# EAGLE board IF_TEST_1 (EAGLE 6.5.0)
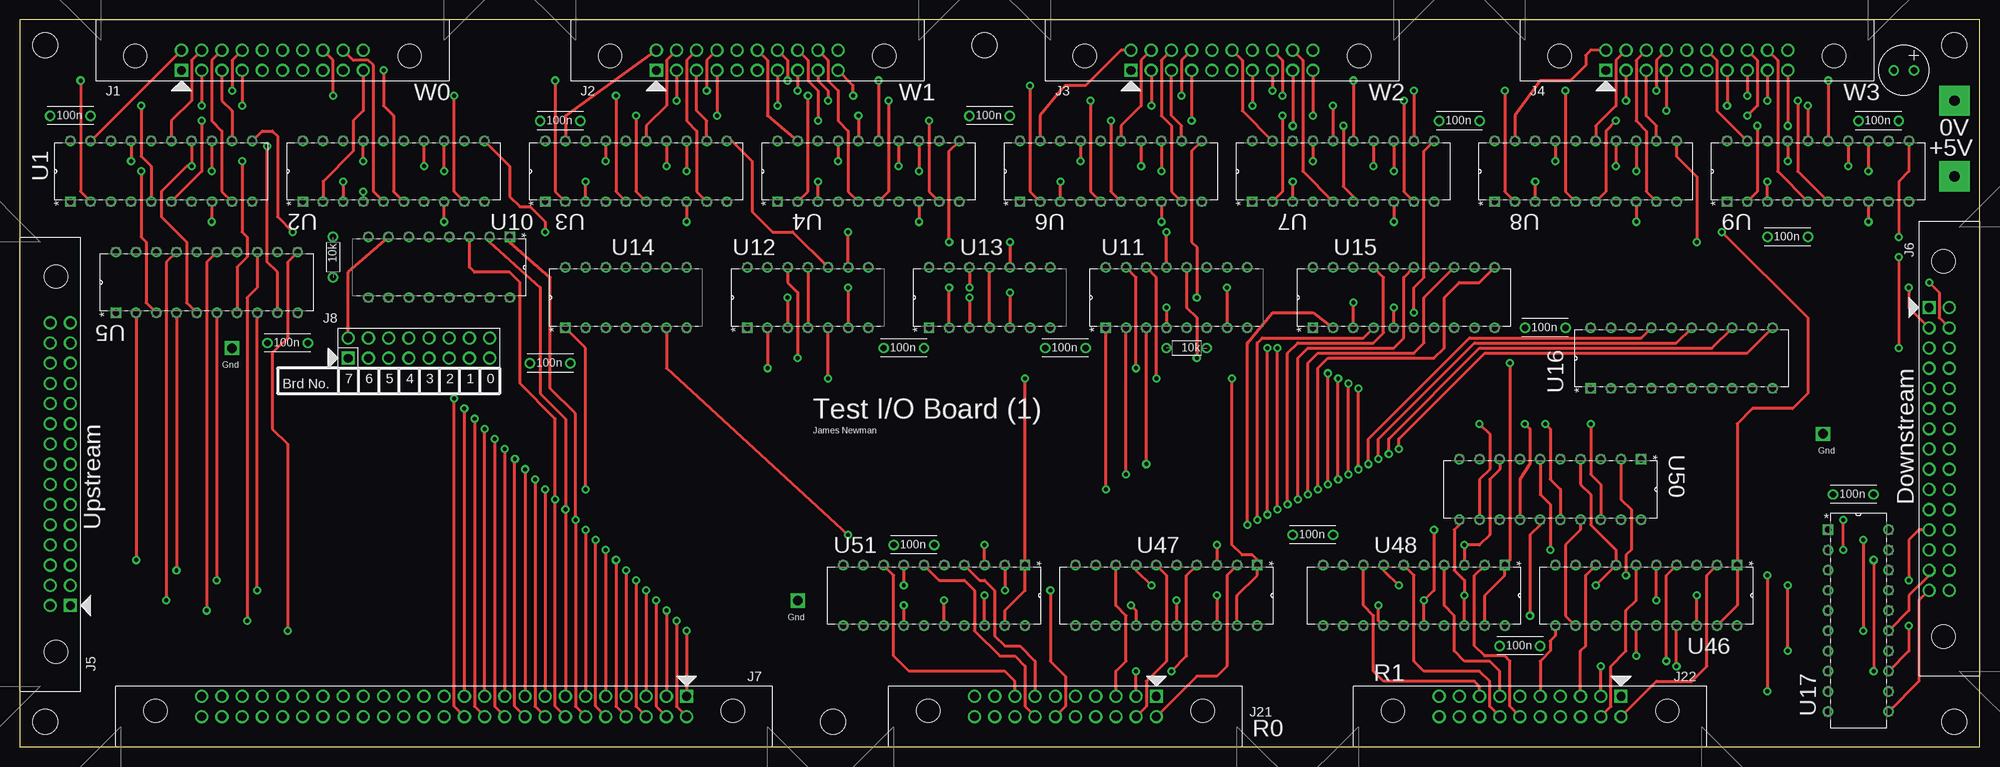
[diagram p6: board, top side]
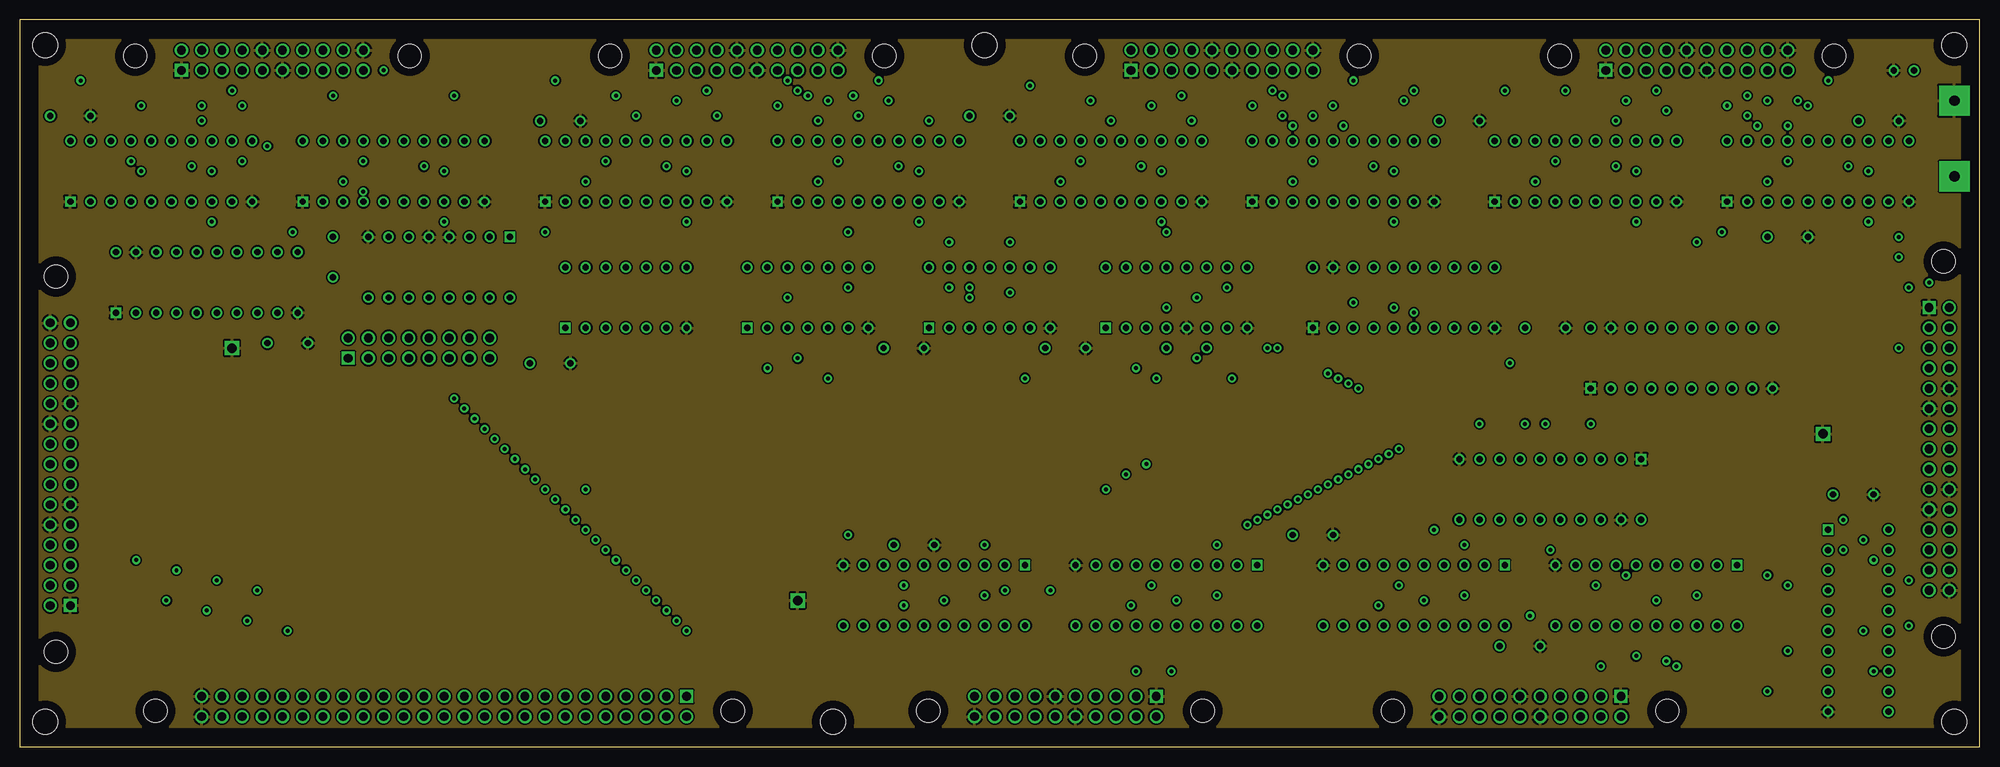
[diagram p7: board, inner layer Route2]
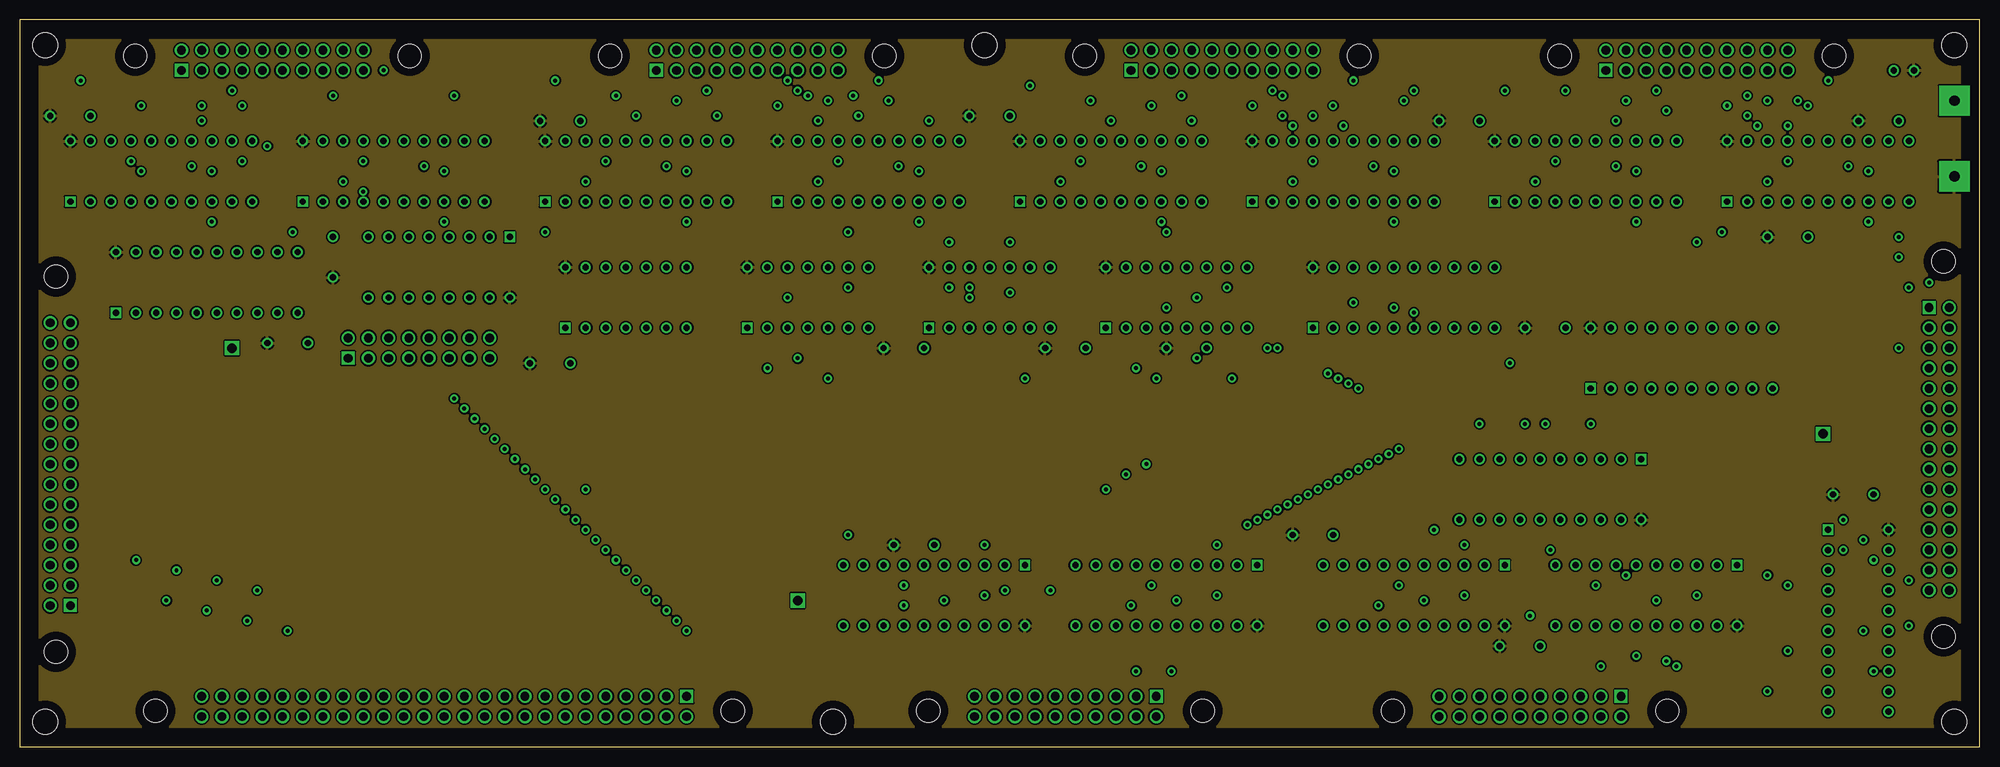
[diagram p8: board, inner layer Route3]
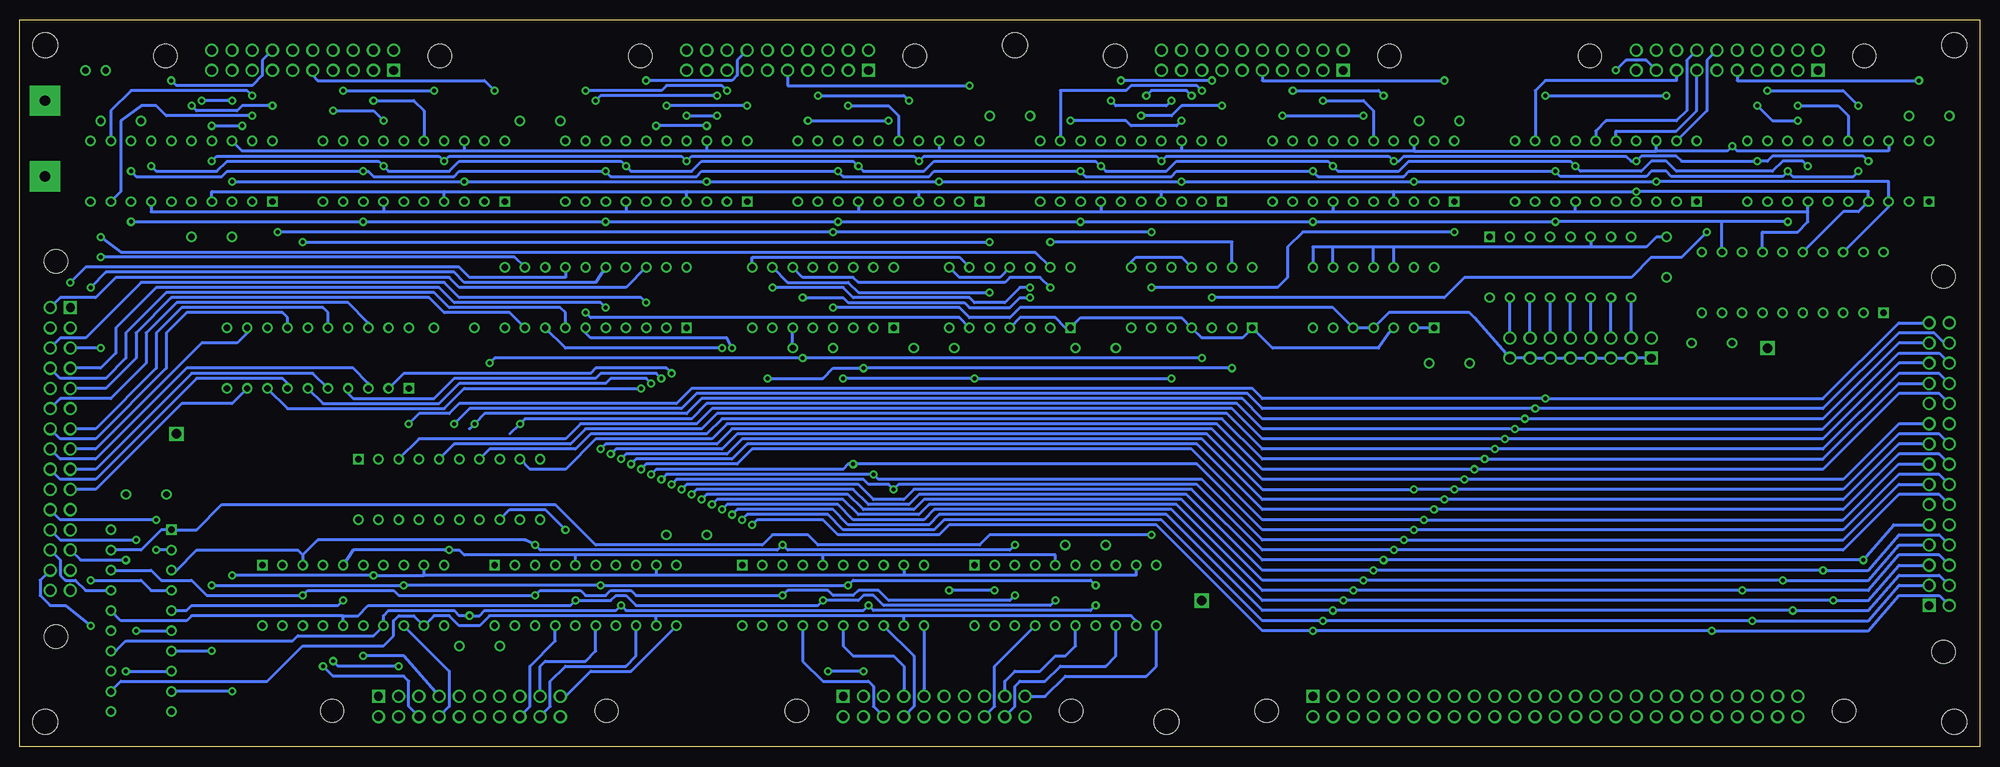
[diagram p9: board, bottom side, seen from below]

Size 246.38 x 91.44 mm. Coordinates in mm from the lower left corner, seen from the top.
Outline: 0,0 246.38,0 246.38,91.44 0,91.44 0,0
Copper layers (1*2+3*16): Top 0.035mm / dielectric 0.2mm / Route2 0.035mm / dielectric 1mm / Route3 0.035mm / dielectric 0.2mm / Bottom 0.035mm
Design rules "processor_rules_4layer": minimum track width 10mil, minimum drill 0.0236mm, track to track 8mil, track to pad 8mil, pad to pad 8mil, via to via 8mil, smd to smd 8mil, copper to edge 40mil, drill to drill 8mil, minimum pad ring 10mil, minimum via ring 8mil, stop-mask expansion 4mil, vias tented up to drill 0.7mm, thermal gap 10mil

## Footprints (pad centres in the part's own frame; a part is rotated, then mirrored left to right if it is on the bottom)
POLARISED_CAP_2P5_6P3MM = drill 0.8: A 1.27,0; K -1.27,0
CAP_P2INCH = drill 0.8: 1 -2.54,0; 2 2.54,0
3M_HOLE = hole 3.2: 0,0
20_HDR_LOCKING_RA = drill 1.1 square: 1 -11.43,-1.27 | drill 1.1: 2 -11.43,1.27; 3 -8.89,-1.27; 4 -8.89,1.27; 5 -6.35,-1.27; 6 -6.35,1.27; 7 -3.81,-1.27; 8 -3.81,1.27; 9 -1.27,-1.27; 10 -1.27,1.27; 11 1.27,-1.27; 12 1.27,1.27; 13 3.81,-1.27; 14 3.81,1.27; 15 6.35,-1.27; 16 6.35,1.27; 17 8.89,-1.27; 18 8.89,1.27; 19 11.43,-1.27; 20 11.43,1.27 | hole 2.946: -17.247,0.533; 17.247,0.533
30_HDR_LOCKING_RA = drill 1.1 square: 1 -17.78,-1.27 | drill 1.1: 2 -17.78,1.27; 3 -15.24,-1.27; 4 -15.24,1.27; 5 -12.7,-1.27; 6 -12.7,1.27; 7 -10.16,-1.27; 8 -10.16,1.27; 9 -7.62,-1.27; 10 -7.62,1.27; 11 -5.08,-1.27; 12 -5.08,1.27; 13 -2.54,-1.27; 14 -2.54,1.27; 15 0,-1.27; 16 0,1.27; 17 2.54,-1.27; 18 2.54,1.27; 19 5.08,-1.27; 20 5.08,1.27; 21 7.62,-1.27; 22 7.62,1.27; 23 10.16,-1.27; 24 10.16,1.27; 25 12.7,-1.27; 26 12.7,1.27; 27 15.24,-1.27; 28 15.24,1.27; 29 17.78,-1.27; 30 17.78,1.27 | hole 2.946: -23.597,0.533; 23.597,0.533
50_HDR_LOCKING_RA = drill 1.1 square: 1 -30.48,-1.27 | drill 1.1: 2 -30.48,1.27; 3 -27.94,-1.27; 4 -27.94,1.27; 5 -25.4,-1.27; 6 -25.4,1.27; 7 -22.86,-1.27; 8 -22.86,1.27; 9 -20.32,-1.27; 10 -20.32,1.27; 11 -17.78,-1.27; 12 -17.78,1.27; 13 -15.24,-1.27; 14 -15.24,1.27; 15 -12.7,-1.27; 16 -12.7,1.27; 17 -10.16,-1.27; 18 -10.16,1.27; 19 -7.62,-1.27; 20 -7.62,1.27; 21 -5.08,-1.27; 22 -5.08,1.27; 23 -2.54,-1.27; 24 -2.54,1.27; 25 0,-1.27; 26 0,1.27; 27 2.54,-1.27; 28 2.54,1.27; 29 5.08,-1.27; 30 5.08,1.27; 31 7.62,-1.27; 32 7.62,1.27; 33 10.16,-1.27; 34 10.16,1.27; 35 12.7,-1.27; 36 12.7,1.27; 37 15.24,-1.27; 38 15.24,1.27; 39 17.78,-1.27; 40 17.78,1.27; 41 20.32,-1.27; 42 20.32,1.27; 43 22.86,-1.27; 44 22.86,1.27; 45 25.4,-1.27; 46 25.4,1.27; 47 27.94,-1.27; 48 27.94,1.27; 49 30.48,-1.27; 50 30.48,1.27 | hole 2.946: -36.297,0.533; 36.297,0.533
JUMP_8X2 = drill 1.1 square: 1 -8.89,-1.27 | drill 1.1: 2 -8.89,1.27; 3 -6.35,-1.27; 4 -6.35,1.27; 5 -3.81,-1.27; 6 -3.81,1.27; 7 -1.27,-1.27; 8 -1.27,1.27; 9 1.27,-1.27; 10 1.27,1.27; 11 3.81,-1.27; 12 3.81,1.27; 13 6.35,-1.27; 14 6.35,1.27; 15 8.89,-1.27; 16 8.89,1.27
POWER_PAD = drill 1.3 pad 3.81 square: 1 0,0
R_P2INCH = drill 0.8: 1 -2.54,0; 2 2.54,0
TEST_LOOP = drill 1.2 square: P$1 0,0
DIP20 = drill 0.8 square: 1 -3.81,11.43 | drill 0.8: 2 -3.81,8.89; 3 -3.81,6.35; 4 -3.81,3.81; 5 -3.81,1.27; 6 -3.81,-1.27; 7 -3.81,-3.81; 8 -3.81,-6.35; 9 -3.81,-8.89; 10 -3.81,-11.43; 11 3.81,-11.43; 12 3.81,-8.89; 13 3.81,-6.35; 14 3.81,-3.81; 15 3.81,-1.27; 16 3.81,1.27; 17 3.81,3.81; 18 3.81,6.35; 19 3.81,8.89; 20 3.81,11.43
DIP16 = drill 0.8 square: 1 -3.81,8.89 | drill 0.8: 2 -3.81,6.35; 3 -3.81,3.81; 4 -3.81,1.27; 5 -3.81,-1.27; 6 -3.81,-3.81; 7 -3.81,-6.35; 8 -3.81,-8.89; 9 3.81,-8.89; 10 3.81,-6.35; 11 3.81,-3.81; 12 3.81,-1.27; 13 3.81,1.27; 14 3.81,3.81; 15 3.81,6.35; 16 3.81,8.89
DIP14 = drill 0.8 square: 1 -3.81,7.62 | drill 0.8: 2 -3.81,5.08; 3 -3.81,2.54; 4 -3.81,0; 5 -3.81,-2.54; 6 -3.81,-5.08; 7 -3.81,-7.62; 8 3.81,-7.62; 9 3.81,-5.08; 10 3.81,-2.54; 11 3.81,0; 12 3.81,2.54; 13 3.81,5.08; 14 3.81,7.62

## Placement (x,y rotation side)
C1  100u  [POLARISED_CAP_2P5_6P3MM]  236.85,85.09 0 top
C2  100n  [CAP_P2INCH]  230.5,31.75 0 top
C3  100n  [CAP_P2INCH]  162.56,26.67 0 top
C4  100n  [CAP_P2INCH]  6.35,79.38 0 top
C5  100n  [CAP_P2INCH]  233.68,78.74 0 top
C6  100n  [CAP_P2INCH]  180.97,78.74 0 top
C7  100n  [CAP_P2INCH]  121.92,79.38 0 top
C8  100n  [CAP_P2INCH]  66.67,48.26 0 top
C9  100n  [CAP_P2INCH]  67.94,78.74 0 top
C10  100n  [CAP_P2INCH]  33.66,50.8 0 top
C11  100n  [CAP_P2INCH]  111.12,50.16 0 top
C12  100n  [CAP_P2INCH]  131.44,50.16 0 top
C13  100n  [CAP_P2INCH]  222.25,64.14 0 top
C14  100n  [CAP_P2INCH]  191.77,52.7 0 top
C15  100n  [CAP_P2INCH]  112.39,25.4 0 top
C16  100n  [CAP_P2INCH]  188.59,12.7 0 top
HOLE1  3M_MOUNT_HOLE  [3M_HOLE]  3.17,3.17 0 top
HOLE2  3M_MOUNT_HOLE  [3M_HOLE]  102.23,3.17 0 top
HOLE3  3M_MOUNT_HOLE  [3M_HOLE]  243.21,88.27 0 top
HOLE4  3M_MOUNT_HOLE  [3M_HOLE]  243.21,3.17 0 top
HOLE5  3M_MOUNT_HOLE  [3M_HOLE]  121.28,88.27 0 top
HOLE6  3M_MOUNT_HOLE  [3M_HOLE]  3.17,88.27 0 top
J1  20_HDR_LOCKING_RA  [20_HDR_LOCKING_RA]  31.75,86.36 0 top
J2  20_HDR_LOCKING_RA  [20_HDR_LOCKING_RA]  91.44,86.36 0 top
J3  20_HDR_LOCKING_RA  [20_HDR_LOCKING_RA]  151.13,86.36 0 top
J4  20_HDR_LOCKING_RA  [20_HDR_LOCKING_RA]  210.82,86.36 0 top
J5  30_HDR_LOCKING_RA  [30_HDR_LOCKING_RA]  5.08,35.56 90 top
J6  30_HDR_LOCKING_RA  [30_HDR_LOCKING_RA]  241.3,37.47 270 top
J7  50_HDR_LOCKING_RA  [50_HDR_LOCKING_RA]  53.34,5.08 180 top
J8  JUMP_8X2  [JUMP_8X2]  50.16,50.16 0 top
J21  20_HDR_LOCKING_RA  [20_HDR_LOCKING_RA]  131.44,5.08 180 top
J22  20_HDR_LOCKING_RA  [20_HDR_LOCKING_RA]  189.87,5.08 180 top
PP1  POWER_PAD  [POWER_PAD]  243.21,71.75 0 top
PP2  POWER_PAD  [POWER_PAD]  243.21,81.28 0 top
R1  10k  [R_P2INCH]  146.69,50.16 180 top
R2  10k  [R_P2INCH]  39.37,61.59 270 top
TP1  [TEST_LOOP]  97.79,18.41 0 top
TP2  [TEST_LOOP]  226.69,39.37 0 top
TP3  [TEST_LOOP]  26.67,50.16 0 top
U1  74LS374  [DIP20]  17.78,72.39 90 top
U2  74LS374  [DIP20]  46.99,72.39 90 top
U3  74LS374  [DIP20]  77.47,72.39 90 top
U4  74LS374  [DIP20]  106.68,72.39 90 top
U5  74LS244  [DIP20]  23.5,58.42 90 top
U6  74LS374  [DIP20]  137.16,72.39 90 top
U7  74LS374  [DIP20]  166.37,72.39 90 top
U8  74LS374  [DIP20]  196.85,72.39 90 top
U9  74LS374  [DIP20]  226.06,72.39 90 top
U10  74LS138  [DIP16]  52.7,60.33 270 top
U11  74LS138  [DIP16]  145.41,56.52 90 top
U12  74LS02  [DIP14]  99.06,56.52 90 top
U13  74LS02  [DIP14]  121.92,56.52 90 top
U14  74LS02  [DIP14]  76.2,56.52 90 top
U15  74LS244  [DIP20]  173.99,56.52 90 top
U16  74LS244  [DIP20]  208.91,48.9 90 top
U17  74LS244  [DIP20]  231.14,15.88 0 top
U46  74LS244  [DIP20]  204.47,19.05 270 top
U47  74LS244  [DIP20]  144.15,19.05 270 top
U48  74LS244  [DIP20]  175.26,19.05 270 top
U50  74LS244  [DIP20]  192.41,32.38 270 top
U51  74LS244  [DIP20]  114.94,19.05 270 top

## Tracks (layer width: path | path; a pad name or v marks a point on that pad's centre or on a via)
+5V
  pour Route3: 243.84,88.9 243.84,2.54 2.54,2.54 2.54,88.9
BEN_0  (via drill 0.5 pad 1.02)
  Top 0.406: U47.19 153.03,19.05 155.57,21.59 U47.1 155.57,23.5 154.94,24.13 153.67,24.13 152.4,25.4 v152.4,46.35 | U12.2 v93.98,47.62 | v140.34,47.62 140.34,59.05 U11.15
  Bottom 0.406: v93.98,47.62 v140.34,47.62 144.15,47.62 145.41,46.35 v152.4,46.35
BEN_1  (via drill 0.5 pad 1.02)
  Top 0.406: U51.19 123.83,17.14 126.36,19.68 U51.1 v126.36,46.35 | v142.88,46.35 142.88,59.05 U11.14 | v101.6,46.35 U12.5
  Bottom 0.406: v142.88,46.35 v126.36,46.35 v101.6,46.35
BEN_2  (via drill 0.5 pad 1.02)
  Top 0.406: U46.19 215.9,17.78 U46.1 215.9,40.64 217.81,42.55 222.88,42.55 224.79,44.45 224.79,53.98 v214,64.77 | U11.13 v144.15,64.77 | U12.9 v104.14,64.77
  Bottom 0.406: v214,64.77 v144.15,64.77 v104.14,64.77
BEN_3  (via drill 0.5 pad 1.02)
  Top 0.406: U48.19 184.15,19.05 186.69,21.59 U48.1 187.32,23.5 v187.32,48.26 | U11.12 146.69,55.24 147.96,53.98 v147.96,48.9 | U12.12 96.52,58.42 97.79,57.15 v97.79,48.9
  Bottom 0.406: v187.32,48.26 186.69,48.9 v147.96,48.9 v97.79,48.9
BF_CTRL_0
  Bottom 0.406: U16.18 202.56,53.34 205.1,55.88 226.69,55.88 230.5,52.07 230.5,48.26 234.95,43.81 241.3,43.81 J6.12
BF_CTRL_1
  Bottom 0.406: U16.16 207.65,54.61 208.28,55.24 226.06,55.24 229.24,52.07 229.24,47.62 236.85,40.01 J6.13
BF_CTRL_2
  Bottom 0.406: U16.14 212.72,53.98 213.36,54.61 225.43,54.61 227.97,52.07 227.97,47.62 236.85,38.73 241.3,38.73 J6.14
BF_CTRL_3
  Bottom 0.406: U16.12 217.81,52.07 219.07,50.8 223.52,50.8 236.85,37.47 J6.15
BF_CTRL_4
  Bottom 0.406: U16.3 202.56,45.72 204.47,47.62 225.43,47.62 236.85,36.2 241.3,36.2 J6.16
BF_CTRL_5
  Bottom 0.406: U16.5 209.55,46.99 224.79,46.99 236.85,34.92 J6.17
BF_CTRL_6
  Bottom 0.406: U16.7 212.72,45.72 213.36,46.35 224.16,46.35 236.85,33.66 241.3,33.66 J6.18
BF_CTRL_7
  Bottom 0.406: U16.9 219.71,43.18 226.06,43.18 236.85,32.38 J6.19
BF_WR_BUS_0
  Bottom 0.406: U15.18 170.18,57.78 191.13,57.78 192.41,59.05 234.31,59.05 236.85,56.52 241.3,56.52 J6.2
BF_WR_BUS_1  (via drill 0.5 pad 1.02)
  Top 0.406: v237.49,57.78 237.49,55.24 J6.3
  Bottom 0.406: U15.16 173.99,58.42 190.5,58.42 191.77,59.69 235.59,59.69 v237.49,57.78
BF_WR_BUS_2  (via drill 0.5 pad 1.02)
  Top 0.406: v240.03,58.42 241.3,57.15 241.3,53.98 J6.4
  Bottom 0.406: U15.14 177.8,59.05 189.87,59.05 191.13,60.33 238.12,60.33 v240.03,58.42
BF_WR_BUS_3  (via drill 0.5 pad 1.02)
  Top 0.406: v236.22,61.59 v236.22,50.16
  Bottom 0.406: U15.12 184.15,61.59 v236.22,61.59 | v236.22,50.16 J6.5
BF_WR_BUS_4  (via drill 0.5 pad 1.02)
  Top 0.406: U15.3 v167.64,55.88
  Bottom 0.406: v167.64,55.88 168.28,56.52 191.13,56.52 193.04,58.42 231.14,58.42 238.12,51.44 241.3,51.44 J6.6
BF_WR_BUS_5  (via drill 0.5 pad 1.02)
  Top 0.406: U15.5 v172.72,55.24
  Bottom 0.406: v172.72,55.24 173.35,55.88 191.77,55.88 193.68,57.78 229.24,57.78 234.31,52.7 234.31,49.53 236.22,47.62 J6.7
BF_WR_BUS_6
  Bottom 0.406: U15.7 177.8,54.61 178.44,55.24 192.41,55.24 194.31,57.15 227.97,57.15 233.04,52.07 233.04,48.9 235.59,46.35 241.3,46.35 J6.8
BF_WR_BUS_7
  Bottom 0.406: U15.9 184.78,54.61 193.04,54.61 194.94,56.52 227.33,56.52 231.78,52.07 231.78,48.9 235.59,45.09 J6.9
BRD_SEL  (via drill 0.5 pad 1.02)
  Top 0.406: U14.6 81.28,47.62 v104.14,26.67
  Bottom 0.406: U17.19 231.14,24.77 228.6,27.3 U17.1 224.16,27.3 220.98,30.48 179.07,30.48 173.99,25.4 153.03,25.4 151.76,26.67 147.32,26.67 146.05,25.4 125.73,25.4 124.46,26.67 v104.14,26.67
BRD_SEL_N  (via drill 0.5 pad 1.02)
  Top 0.406: v144.15,55.24 U11.4
  Bottom 0.406: J8.1 J8.3 J8.5 J8.7 J8.9 J8.11 J8.13 J8.15 63.5,53.98 64.14,54.61 74.3,54.61 U14.4 U14.5 81.28,55.24 120.65,55.24 121.92,53.98 127,53.98 128.27,55.24 v144.15,55.24
CLK_0  (via drill 0.5 pad 1.02)
  Top 0.406: U1.11 30.48,77.47 31.75,77.47 32.38,76.83 32.38,66.67 v34.29,64.77 | v96.52,56.52 U12.3
  Bottom 0.406: v96.52,56.52 67.31,56.52 64.77,59.05 43.81,59.05 41.27,61.59 37.47,61.59 v34.29,64.77
CLK_1  (via drill 0.5 pad 1.02)
  Top 0.406: v104.14,57.78 U12.6 | U2.11 61.59,73.03 61.59,69.22 62.87,67.94 64.14,67.94 66.04,66.04 v66.04,64.77
  Bottom 0.406: v66.04,64.77 85.09,64.77 87,62.87 87,59.05 88.27,57.78 v104.14,57.78
CLK_2
  Top 0.406: U3.11 89.53,76.2 92.08,73.66 92.08,67.31 94.61,64.77 97.16,64.77 U12.10
CLK_3  (via drill 0.5 pad 1.02)
  Top 0.406: v116.84,63.5 116.84,74.93 U4.11
  Bottom 0.406: U12.13 93.98,63.5 v116.84,63.5
CLK_4  (via drill 0.5 pad 1.02)
  Top 0.406: U6.11 147.32,74.93 147.32,63.5 147.96,62.87 v147.96,56.52 | v119.38,56.52 U13.3
  Bottom 0.406: v147.96,56.52 142.88,56.52 142.24,55.88 127.64,55.88 127,55.24 121.92,55.24 120.65,56.52 v119.38,56.52
CLK_5  (via drill 0.5 pad 1.02)
  Top 0.406: v175.26,54.61 175.26,57.78 176.53,59.05 176.53,74.93 U7.11
  Bottom 0.406: U13.6 128.27,53.98 174.62,53.98 v175.26,54.61
CLK_6  (via drill 0.5 pad 1.02)
  Top 0.406: U8.11 208.28,74.3 210.82,71.75 v210.82,63.5 | v124.46,63.5 U13.10
  Bottom 0.406: v210.82,63.5 v124.46,63.5
CLK_7  (via drill 0.5 pad 1.02)
  Top 0.406: U9.11 237.49,72.39 236.22,71.12 v236.22,64.14
  Bottom 0.406: v236.22,64.14 233.68,62.23 118.75,62.23 U13.13
CTRL_0  (via drill 0.5 pad 1.02)
  Top 0.406: v73.66,24.77 J7.9 | v136.53,32.38 U11.1 | v164.47,33.02 v164.47,46.99
  Bottom 0.406: J5.12 5.08,31.75 10.16,31.75 17.14,24.77 v73.66,24.77 90.17,24.77 98.42,33.02 135.89,33.02 v136.53,32.38 137.16,33.02 139.7,33.02 140.34,33.66 163.83,33.66 v164.47,33.02 | U16.2 198.12,46.99 174.62,46.99 173.99,47.62 165.1,47.62 v164.47,46.99
CTRL_1  (via drill 0.5 pad 1.02)
  Top 0.406: J7.10 72.39,5.08 v72.39,26.04 | v139.06,34.29 U11.2 | v165.74,33.66 v165.74,46.35
  Bottom 0.406: J5.13 10.16,33.02 17.14,26.04 v72.39,26.04 90.17,26.04 97.79,33.66 138.43,33.66 v139.06,34.29 165.1,34.29 v165.74,33.66 | U16.4 205.1,44.45 204.47,43.81 194.31,43.81 191.77,46.35 173.99,46.35 173.35,46.99 166.37,46.99 v165.74,46.35
CTRL_2  (via drill 0.5 pad 1.02)
  Top 0.406: v71.12,27.3 J7.11 | v141.6,35.56 U11.3 | v167,34.29 v167,45.72
  Bottom 0.406: J5.14 5.08,34.29 10.16,34.29 17.14,27.3 v71.12,27.3 90.17,27.3 98.42,35.56 v141.6,35.56 142.24,35.56 142.88,34.92 166.37,34.92 v167,34.29 | U16.6 208.28,43.18 193.68,43.18 191.13,45.72 172.72,45.72 172.09,46.35 167.64,46.35 v167,45.72
CTRL_3  (via drill 0.5 pad 1.02)
  Top 0.406: J7.12 69.85,5.08 v69.85,28.57 69.85,41.91 66.67,45.09 66.67,59.05 61.59,63.5 U10.1 | v168.28,34.92 v168.28,45.09
  Bottom 0.406: v168.28,34.92 167.64,35.56 156.21,35.56 154.31,37.47 99.06,37.47 90.17,28.57 v69.85,28.57 17.14,28.57 10.16,35.56 J5.15 | U16.8 212.72,42.55 193.04,42.55 190.5,45.09 v168.28,45.09
CTRL_4  (via drill 0.5 pad 1.02)
  Top 0.406: J7.13 v68.58,29.84 68.58,41.27 65.41,44.45 65.41,57.78 59.05,63.5 U10.2 | v169.54,35.56 169.54,38.73 182.25,51.44 203.84,51.44 U16.17
  Bottom 0.406: J5.16 5.08,36.83 10.16,36.83 17.14,29.84 v68.58,29.84 90.17,29.84 98.42,38.1 154.94,38.1 156.84,36.2 168.91,36.2 v169.54,35.56
CTRL_5  (via drill 0.5 pad 1.02)
  Top 0.406: J7.14 67.31,5.08 v67.31,31.11 67.31,41.27 62.87,45.72 62.87,58.42 61.59,59.69 57.15,59.69 56.52,60.33 U10.3 | v170.81,36.2 170.81,38.73 182.88,50.8 208.28,50.8 U16.15
  Bottom 0.406: J5.17 10.16,38.1 17.14,31.11 v67.31,31.11 90.17,31.11 97.79,38.73 155.57,38.73 157.48,36.83 170.18,36.83 v170.81,36.2
CTRL_6  (via drill 0.5 pad 1.02)
  Top 0.406: v66.04,32.38 J7.15 | v172.09,36.83 172.09,38.73 183.51,50.16 212.72,50.16 U16.13 | v71.12,32.38 71.12,50.16 U14.1
  Bottom 0.406: J5.18 5.08,39.37 10.16,39.37 17.14,32.38 v66.04,32.38 v71.12,32.38 90.17,32.38 97.16,39.37 156.21,39.37 158.12,37.47 171.45,37.47 v172.09,36.83 | U14.1 U14.2
CTRL_7  (via drill 0.5 pad 1.02)
  Top 0.406: v64.77,33.66 64.77,5.08 J7.16 | v173.35,37.47 173.35,38.73 184.15,49.53 217.17,49.53 U16.11
  Bottom 0.406: J5.19 10.16,40.64 17.14,33.66 v64.77,33.66 90.17,33.66 96.52,40.01 156.84,40.01 158.75,38.1 172.72,38.1 v173.35,37.47
GND
  pour Route2: 243.84,88.9 243.84,2.54 2.54,2.54 2.54,88.9
IN0
  Top 0.406: U47.2 151.76,21.59 151.76,10.16 150.5,8.89 147.96,8.89 J21.2
IN1  (via drill 0.5 pad 1.02)
  Top 0.406: J21.3 v140.34,9.53 | v144.78,9.53 146.69,11.43 146.69,21.59 U47.4
  Bottom 0.406: v140.34,9.53 v144.78,9.53
IN2
  Top 0.406: U47.6 144.15,21.59 144.15,10.79 141.6,8.26 141.6,5.08 J21.4
IN3
  Top 0.406: J21.5 137.79,9.53 139.06,10.79 139.06,16.51 137.79,17.78 U47.8
IN4
  Bottom 0.406: U47.17 147.96,10.79 145.41,8.26 139.7,8.26 139.06,7.62 139.06,5.08 J21.6
IN5
  Bottom 0.406: U47.15 142.88,12.7 141.6,11.43 136.53,11.43 135.25,10.16 J21.7
IN6
  Bottom 0.406: U47.13 133.99,11.43 133.99,5.08 J21.8
IN7
  Bottom 0.406: U47.11 J21.9
IN8  (via drill 0.5 pad 1.02)
  Top 0.406: U51.2 v123.83,19.68 | v129.54,19.68 129.54,10.79 131.44,8.89 131.44,5.08 J21.12
  Bottom 0.406: v123.83,19.68 v129.54,19.68
IN9
  Top 0.406: U51.4 120.65,20.95 121.28,20.95 122.56,19.68 122.56,13.97 123.83,12.7 125.73,12.7 127.64,10.79 J21.13
IN10
  Top 0.406: U51.6 115.57,20.95 118.75,20.95 120.02,19.68 120.02,14.61 123.19,11.43 125.09,11.43 126.36,10.16 126.36,5.08 J21.14
IN11
  Top 0.406: J21.15 125.09,8.26 123.83,9.53 111.76,9.53 109.86,11.43 109.86,21.59 U51.8
IN12
  Bottom 0.406: J21.16 123.83,5.08 123.83,10.16 U51.17
IN13
  Bottom 0.406: J21.17 122.56,8.26 121.28,9.53 118.11,9.53 116.2,11.43 114.94,11.43 113.67,12.7 U51.15
IN14
  Bottom 0.406: J21.18 121.28,5.08 121.28,7.62 120.65,8.26 117.47,8.26 115.57,10.16 109.86,10.16 108.58,11.43 U51.13
IN15
  Bottom 0.406: J21.19 117.47,6.35 114.94,8.89 104.78,8.89 103.5,10.16 U51.11
IN_RD_BUS_0  (via drill 0.5 pad 1.02)
  Top 0.406: v229.24,24.77 v229.24,28.57
  Bottom 0.406: U17.2 v229.24,24.77 | v229.24,28.57 241.3,28.57 J6.22
IN_RD_BUS_1  (via drill 0.5 pad 1.02)
  Top 0.406: J6.23 238.76,27.3 237.49,26.04 v237.49,20.95
  Bottom 0.406: v237.49,20.95 231.14,20.95 229.87,19.68 U17.4
IN_RD_BUS_2  (via drill 0.5 pad 1.02)
  Top 0.406: v231.78,26.04 v231.78,14.61
  Bottom 0.406: J6.24 241.3,26.04 v231.78,26.04 | v231.78,14.61 U17.6
IN_RD_BUS_3  (via drill 0.5 pad 1.02)
  Top 0.406: v233.04,23.5 v233.04,9.53
  Bottom 0.406: J6.25 238.76,23.5 v233.04,23.5 | v233.04,9.53 U17.8
IN_RD_BUS_4
  Bottom 0.406: J6.26 241.3,23.5 241.3,21.59 240.66,20.95 239.4,20.95 238.12,19.68 U17.17
IN_RD_BUS_5
  Top 0.406: J6.27 240.03,21.59 237.49,19.05 237.49,17.14 U17.15
IN_RD_BUS_6  (via drill 0.5 pad 1.02)
  Top 0.406: v237.49,15.24 237.49,12.06 U17.13
  Bottom 0.406: J6.28 243.84,20.95 243.84,19.05 242.57,17.78 240.66,17.78 v237.49,15.24
IN_RD_BUS_7
  Top 0.406: J6.29 238.76,18.41 238.76,8.26 U17.11
N$1
  Top 0.406: J2.2 68.58,79.38 U3.19
N$3
  Top 0.406: J8.2 41.27,59.69 U10.7
N$4
  Bottom 0.406: J8.4 U10.9
N$5
  Bottom 0.406: J8.6 U10.10
N$6
  Bottom 0.406: J8.8 U10.11
N$7
  Bottom 0.406: J8.10 U10.12
N$8
  Bottom 0.406: J8.12 U10.13
N$9
  Bottom 0.406: J8.14 U10.14
N$10
  Bottom 0.406: J8.16 U10.15
N$13
  Bottom 0.406: U10.6 48.9,62.87 | 48.9,62.87 73.66,62.87 | 73.66,62.87 76.2,62.87 | 76.2,62.87 81.28,62.87 | 81.28,62.87 83.82,62.87 U14.8 | R2.1 40.64,64.14 41.91,62.87 48.9,62.87 | U14.12 73.66,62.87 | U14.11 76.2,62.87 | U14.9 81.28,62.87
N$14
  Top 0.406: U12.11 U12.4 | U13.4 U13.11
  Bottom 0.406: U14.3 74.3,52.07 75.56,50.16 88.9,50.16 U12.1 92.71,51.44 97.79,51.44 U12.4 100.33,53.98 113.03,53.98 U13.1 114.94,52.7 116.2,53.98 120.65,53.98 U13.4 | U12.8 106.68,60.96 106.05,61.59 100.33,61.59 U12.11 | U13.11 123.19,59.05 128.27,59.05 U13.8
N$18  (via drill 0.5 pad 1.02)
  Top 0.406: J2.3 v82.55,81.28
  Bottom 0.406: v82.55,81.28 77.47,81.28 76.2,80.01 U3.16
N$19
  Top 0.406: J2.4 81.28,86.36 81.28,80.64 78.74,78.11 U3.15
N$20
  Top 0.406: U3.12 86.36,78.74 85.09,80.01 J2.5
N$21
  Top 0.406: J2.6 83.82,86.36 83.82,78.74 85.09,77.47 85.09,69.85 U3.9
N$22  (via drill 0.5 pad 1.02)
  Top 0.406: J2.7 v87.63,79.38 | v77.47,79.38 77.47,69.85 U3.6
  Bottom 0.406: v87.63,79.38 v77.47,79.38
N$23  (via drill 0.5 pad 1.02)
  Top 0.406: J2.8 86.36,86.36 v86.36,82.55 | v74.93,81.92 74.93,69.85 U3.5
  Bottom 0.406: v86.36,82.55 75.56,82.55 v74.93,81.92
N$24  (via drill 0.5 pad 1.02)
  Top 0.406: v67.31,83.82 67.31,69.85 U3.2
  Bottom 0.406: J2.9 90.17,83.82 v67.31,83.82
N$25
  Top 0.406: J3.2 138.43,87.63 133.99,83.19 131.44,83.19 130.81,82.55 128.27,79.38 U6.19
N$26  (via drill 0.5 pad 1.02)
  Top 0.406: J3.3 v142.24,80.64
  Bottom 0.406: v142.24,80.64 137.16,80.64 135.89,79.38 U6.16
N$27
  Top 0.406: J2.12 93.98,86.36 93.98,79.38 U4.19
N$28  (via drill 0.5 pad 1.02)
  Top 0.406: J2.13 v95.25,80.64 | v105.41,79.38 U4.16
  Bottom 0.406: v95.25,80.64 100.33,80.64 101.6,79.38 v105.41,79.38
N$29  (via drill 0.5 pad 1.02)
  Top 0.406: J2.14 96.52,86.36 v96.52,83.82 | v107.95,83.82 U4.15
  Bottom 0.406: v96.52,83.82 v107.95,83.82
N$30  (via drill 0.5 pad 1.02)
  Top 0.406: J2.15 v97.79,82.55
  Bottom 0.406: v97.79,82.55 98.42,83.19 106.68,83.19 107.31,82.55 115.57,82.55 U4.12
N$31  (via drill 0.5 pad 1.02)
  Top 0.406: J2.16 99.06,86.36 99.06,83.82 100.33,82.55 v100.33,78.74 | v114.3,78.74 114.3,69.85 U4.9
  Bottom 0.406: v100.33,78.74 100.97,78.11 106.68,78.11 107.31,78.74 v114.3,78.74
N$32  (via drill 0.5 pad 1.02)
  Top 0.406: J2.17 100.33,83.82 101.6,82.55 v101.6,81.28 | v109.22,81.28 109.22,69.85 U4.6
  Bottom 0.406: v101.6,81.28 102.23,80.64 108.58,80.64 v109.22,81.28
N$33
  Top 0.406: J2.18 101.6,86.36 101.6,83.82 102.87,82.55 102.87,78.74 104.14,77.47 104.14,69.85 U4.5
N$34  (via drill 0.5 pad 1.02)
  Top 0.406: U4.2 99.06,69.85 v99.06,81.92 | v104.78,81.92 104.78,83.19 J2.19
  Bottom 0.406: v99.06,81.92 99.69,82.55 104.14,82.55 v104.78,81.92
N$35
  Top 0.406: J3.4 140.97,86.36 140.97,80.64 138.43,78.11 U6.15
N$36
  Top 0.406: U6.12 146.05,78.11 144.78,79.38 J3.5
N$37
  Top 0.406: J3.6 143.51,86.36 143.51,79.38 144.78,78.11 144.78,69.85 U6.9
N$38  (via drill 0.5 pad 1.02)
  Top 0.406: J3.7 v147.32,78.74 | v137.16,78.74 137.16,69.85 U6.6
  Bottom 0.406: v147.32,78.74 v137.16,78.74
N$39  (via drill 0.5 pad 1.02)
  Top 0.406: J3.8 146.05,86.36 v146.05,81.92 | v134.62,81.28 134.62,69.85 U6.5
  Bottom 0.406: v146.05,81.92 135.25,81.92 v134.62,81.28
N$40  (via drill 0.5 pad 1.02)
  Top 0.406: v127,83.19 127,69.85 U6.2
  Bottom 0.406: J3.9 149.86,83.19 v127,83.19
N$41
  Top 0.406: J3.12 153.67,86.36 153.67,80.01 U7.19
N$42  (via drill 0.5 pad 1.02)
  Top 0.406: J3.13 v154.94,80.64 | v165.1,80.64 U7.16
  Bottom 0.406: v154.94,80.64 v165.1,80.64
N$43  (via drill 0.5 pad 1.02)
  Top 0.406: v167.64,83.82 U7.15
  Bottom 0.406: J3.14 156.21,86.36 156.21,84.45 156.84,83.82 v167.64,83.82
N$44  (via drill 0.5 pad 1.02)
  Top 0.406: J3.15 v157.48,82.55 | v175.26,82.55 U7.12
  Bottom 0.406: v157.48,82.55 158.12,83.19 165.1,83.19 165.74,82.55 v175.26,82.55
N$45  (via drill 0.5 pad 1.02)
  Top 0.406: J3.16 158.75,86.36 v158.75,81.92 | v173.99,81.28 173.99,69.85 U7.9
  Bottom 0.406: v158.75,81.92 173.35,81.92 v173.99,81.28
N$46  (via drill 0.5 pad 1.02)
  Top 0.406: J3.17 v160.02,78.11 | v166.37,78.11 166.37,70.48 167.64,69.22 U7.6
  Bottom 0.406: v160.02,78.11 v166.37,78.11
N$47
  Top 0.406: J3.18 161.29,86.36 161.29,72.39 U7.5
N$48  (via drill 0.5 pad 1.02)
  Top 0.406: J3.19 v162.56,79.38 | v158.75,79.38 158.75,69.85 U7.2
  Bottom 0.406: v162.56,79.38 v158.75,79.38
N$49
  Top 0.406: J4.2 197.49,87.63 196.85,87 196.85,85.72 194.94,83.82 191.13,83.82 187.96,79.38 U8.19
N$50  (via drill 0.5 pad 1.02)
  Top 0.406: J4.3 v201.93,81.28
  Bottom 0.406: v201.93,81.28 196.85,81.28 195.58,80.01 U8.16
N$51
  Top 0.406: J4.4 200.66,86.36 200.66,80.64 198.12,78.11 U8.15
N$52
  Top 0.406: U8.12 205.74,78.11 204.47,79.38 J4.5
N$53
  Top 0.406: J4.6 203.2,86.36 203.2,78.74 204.47,77.47 204.47,69.85 U8.9
N$54  (via drill 0.5 pad 1.02)
  Top 0.406: J4.7 v207.01,80.01 | v200.66,78.74 199.39,77.47 199.39,69.85 U8.6
  Bottom 0.406: v207.01,80.01 201.93,80.01 v200.66,78.74
N$55  (via drill 0.5 pad 1.02)
  Top 0.406: J4.8 205.74,86.36 v205.74,82.55 | v194.31,82.55 194.31,69.85 U8.5
  Bottom 0.406: v205.74,82.55 v194.31,82.55
N$56  (via drill 0.5 pad 1.02)
  Top 0.406: v186.69,82.55 186.69,69.85 U8.2
  Bottom 0.406: J4.9 209.55,84.45 208.91,83.82 187.96,83.82 v186.69,82.55
N$57
  Top 0.406: J4.12 213.36,86.36 213.36,80.01 U9.19
N$58  (via drill 0.5 pad 1.02)
  Top 0.406: J4.13 v214.63,80.64 | v224.79,80.64 U9.16
  Bottom 0.406: v214.63,80.64 218.44,80.64 219.07,80.01 224.16,80.01 v224.79,80.64
N$59  (via drill 0.5 pad 1.02)
  Top 0.406: v227.33,83.82 U9.15
  Bottom 0.406: J4.14 215.9,86.36 215.9,84.45 217.17,83.19 226.69,83.19 v227.33,83.82
N$60  (via drill 0.5 pad 1.02)
  Top 0.406: J4.15 v217.17,81.92
  Bottom 0.406: v217.17,81.92 217.81,82.55 232.41,82.55 234.95,80.01 U9.12
N$61  (via drill 0.5 pad 1.02)
  Top 0.406: J4.16 218.44,86.36 218.44,80.64 v217.17,79.38
  Bottom 0.406: v217.17,79.38 227.97,79.38 229.24,80.64 231.14,80.64 233.68,78.74 233.68,69.85 U9.9
N$62  (via drill 0.5 pad 1.02)
  Top 0.406: J4.17 v219.71,81.28 | v223.52,81.28 223.52,72.39 U9.6
  Bottom 0.406: v219.71,81.28 v223.52,81.28
N$63
  Top 0.406: J4.18 220.98,86.36 220.98,72.39 U9.5
N$64  (via drill 0.5 pad 1.02)
  Top 0.406: J4.19 v222.25,78.11 | v218.44,78.11 218.44,69.85 U9.2
  Bottom 0.406: v222.25,78.11 v218.44,78.11
N$71  (via drill 0.5 pad 1.02)
  Top 0.406: U13.12 v119.38,57.78 | v151.76,57.78 U11.7
  Bottom 0.406: v119.38,57.78 120.65,57.78 122.56,55.88 126.36,55.88 127,56.52 141.6,56.52 142.88,57.78 v151.76,57.78
N$72
  Bottom 0.406: U11.9 154.31,61.59 128.27,61.59 U13.9
N$73  (via drill 0.5 pad 1.02)
  Top 0.406: v124.46,57.15 U13.5
  Bottom 0.406: U11.10 149.86,58.42 142.24,58.42 140.97,57.15 v124.46,57.15
N$74  (via drill 0.5 pad 1.02)
  Top 0.406: U13.2 v116.84,57.78
  Bottom 0.406: v116.84,57.78 118.11,59.05 121.92,59.05 122.56,58.42 140.97,58.42 141.6,59.05 147.96,59.05 U11.11
N$79
  Bottom 0.406: R1.1 U11.6
N$321
  Top 0.406: J22.2 205.74,8.26 210.19,8.26 212.09,10.16 212.09,21.59 U46.2
N$330  (via drill 0.5 pad 1.02)
  Top 0.406: J22.3 v198.75,10.16 | v207.01,10.79 207.01,21.59 U46.4
  Bottom 0.406: v198.75,10.16 206.38,10.16 v207.01,10.79
N$331
  Top 0.406: J22.4 200.03,5.08 200.03,10.16 201.93,12.06 201.93,17.14 203.2,18.41 U46.6
N$336
  Top 0.406: J22.5 196.22,12.06 196.85,12.7 196.85,21.59 U46.8
N$345  (via drill 0.5 pad 1.02)
  Top 0.406: v208.28,10.16 U46.17
  Bottom 0.406: J22.6 197.49,5.08 197.49,8.26 198.12,8.89 207.01,8.89 v208.28,10.16
N$346  (via drill 0.5 pad 1.02)
  Top 0.406: v203.2,11.43 U46.15
  Bottom 0.406: J22.7 198.12,11.43 v203.2,11.43
N$347
  Bottom 0.406: U46.13 192.41,9.53 192.41,5.08 J22.8
N$348
  Top 0.406: U46.11 193.04,13.97 192.41,13.34 192.41,12.06 191.13,10.79 J22.9
N$349
  Top 0.406: J22.12 187.32,5.08 187.32,10.79 186.69,11.43 184.15,11.43 182.88,12.7 182.88,21.59 U48.2
N$350
  Top 0.406: J22.13 186.06,9.53 184.78,10.79 181.61,10.79 180.34,12.06 180.34,16.51 179.07,17.78 U48.4
N$351
  Top 0.406: J22.14 184.78,5.08 184.78,8.26 183.51,9.53 176.53,9.53 175.26,10.79 175.26,21.59 U48.6
N$352
  Top 0.406: J22.15 183.51,7.62 182.88,8.26 171.45,8.26 170.18,9.53 170.18,16.51 168.91,17.78 U48.8
N$357
  Bottom 0.406: J22.19 177.8,6.35 174.62,9.53 169.54,9.53 U48.11
N$358
  Bottom 0.406: J22.18 179.71,5.08 179.71,8.26 177.8,10.16 170.18,10.16 168.91,11.43 U48.13
N$359
  Bottom 0.406: J22.17 180.97,10.16 180.34,10.79 175.26,10.79 173.99,12.06 U48.15
N$360
  Bottom 0.406: J22.16 182.25,5.08 182.25,10.16 179.07,13.34 U48.17
OUT0
  Top 0.406: J1.2 U1.19
OUT1  (via drill 0.5 pad 1.02)
  Top 0.406: J1.3 v22.86,80.64
  Bottom 0.406: v22.86,80.64 17.78,80.64 16.51,79.38 U1.16
OUT2
  Top 0.406: J1.4 21.59,86.36 21.59,81.28 19.05,78.74 U1.15
OUT3
  Top 0.406: J1.5 25.4,81.28 26.67,80.01 U1.12
OUT4
  Top 0.406: J1.6 24.13,86.36 24.13,78.74 25.4,77.47 25.4,69.85 U1.9
OUT5  (via drill 0.5 pad 1.02)
  Top 0.406: J1.7 v27.94,80.64 | v22.86,78.74 22.86,72.39 U1.6
  Bottom 0.406: v27.94,80.64 26.04,78.74 v22.86,78.74
OUT6  (via drill 0.5 pad 1.02)
  Top 0.406: J1.8 26.67,86.36 v26.67,82.55 | v15.24,80.64 15.24,74.3 16.51,73.03 U1.5
  Bottom 0.406: v26.67,82.55 17.14,82.55 v15.24,80.64
OUT7  (via drill 0.5 pad 1.02)
  Top 0.406: v7.62,83.82 7.62,69.85 U1.2
  Bottom 0.406: J1.9 30.48,83.82 v7.62,83.82
OUT8
  Bottom 0.406: J1.12 34.29,86.36 34.29,80.01 U2.19
OUT9
  Bottom 0.406: U2.16 45.72,77.47 38.1,77.47 35.56,80.01 J1.13
OUT10
  Bottom 0.406: J1.14 36.83,86.36 36.83,80.01 38.1,78.74 46.99,78.74 48.26,77.47 U2.15
OUT11
  Bottom 0.406: J1.15 38.1,83.82 54.61,83.82 55.88,82.55 U2.12
OUT12  (via drill 0.5 pad 1.02)
  Top 0.406: U2.9 54.61,69.85 v54.61,81.92 | v39.37,81.92 39.37,86.36 J1.16
  Bottom 0.406: v54.61,81.92 v39.37,81.92
OUT13  (via drill 0.5 pad 1.02)
  Top 0.406: v45.72,85.09 45.72,80.64 46.99,79.38 46.99,69.85 U2.6
  Bottom 0.406: J1.17 41.91,86.36 44.45,86.36 v45.72,85.09
OUT14
  Top 0.406: U2.5 44.45,69.85 44.45,85.72 43.81,86.36 41.91,86.36 J1.18
OUT15
  Top 0.406: J1.19 43.18,80.01 41.91,78.74 41.91,74.93 38.1,71.12 U2.2
RD_BUS_0  (via drill 0.5 pad 1.02)
  Top 0.406: v63.5,34.92 J7.17
  Bottom 0.406: J5.22 5.08,44.45 10.16,44.45 19.68,34.92 v63.5,34.92 90.17,34.92 95.89,40.64 157.48,40.64 159.38,38.73 173.99,38.73 177.8,34.92 182.25,34.92 U50.9
RD_BUS_0_0  (via drill 0.5 pad 1.02)
  Top 0.406: U51.18 v121.28,19.05 | v150.5,19.05 U47.18 | U48.18 v181.61,19.05 181.61,20.95 180.34,22.23 180.34,27.3 180.97,27.94 U50.11 | U46.18 v210.82,19.05
  Bottom 0.406: v121.28,19.05 121.92,18.41 137.16,18.41 138.43,19.68 140.97,19.68 141.6,19.05 144.15,19.05 144.78,19.68 149.86,19.68 v150.5,19.05 168.91,19.05 169.54,19.68 172.09,19.68 172.72,19.05 175.26,19.05 175.9,19.68 180.97,19.68 v181.61,19.05 198.75,19.05 199.39,19.68 210.19,19.68 v210.82,19.05 222.88,19.05 224.79,20.95 228.6,20.95 229.87,22.23 U17.18
RD_BUS_0_1  (via drill 0.5 pad 1.02)
  Top 0.406: U51.16 v116.2,18.41 | v145.41,18.41 U47.16 | U48.16 v176.53,18.41 177.8,19.68 v177.8,27.3
  Bottom 0.406: v116.2,18.41 116.84,17.78 137.79,17.78 139.06,19.05 140.34,19.05 140.97,18.41 v145.41,18.41 146.05,17.78 168.91,17.78 170.18,19.05 171.45,19.05 172.09,18.41 v176.53,18.41 177.16,17.78 202.56,17.78 203.84,16.51 205.74,16.51 | U46.16 205.74,16.51 | U50.13 184.78,29.84 180.34,29.84 v177.8,27.3 | 205.74,16.51 224.79,16.51 225.43,15.88 233.68,15.88 U17.16
RD_BUS_0_2  (via drill 0.5 pad 1.02)
  Top 0.406: U51.14 v111.12,17.78 | v139.7,17.78 140.34,17.14 U47.14 | U48.14 170.81,15.88 v170.81,17.78 | U50.15 191.13,27.94 189.87,26.67 v189.87,16.51
  Bottom 0.406: v111.12,17.78 111.76,17.14 139.06,17.14 v139.7,17.78 140.34,17.14 170.18,17.14 v170.81,17.78 171.45,17.14 187.96,17.14 188.59,16.51 v189.87,16.51 191.13,16.51 191.77,17.14 200.03,17.14 200.66,16.51 U46.14 201.93,13.97 211.46,13.97 212.09,13.34 233.04,13.34 234.31,12.06 U17.14
RD_BUS_0_3
  Top 0.406: U50.17 196.22,27.3 194.31,25.4 194.31,16.51 U46.12
  Bottom 0.406: U51.12 106.05,15.88 106.68,16.51 135.25,16.51 | 135.25,16.51 166.37,16.51 | 166.37,16.51 187.32,16.51 188.59,15.24 191.13,15.24 192.41,16.51 194.31,16.51 U46.12 196.85,16.51 198.75,16.51 199.39,15.88 199.39,13.97 200.66,12.7 210.82,12.7 215.26,8.26 233.68,8.26 U17.12 | U47.12 135.25,16.51 | U48.12 166.37,16.51
RD_BUS_0_4  (via drill 0.5 pad 1.02)
  Top 0.406: U51.3 v121.28,25.4 | U48.3 v181.61,25.4 183.51,25.4 184.78,26.67 184.78,33.66 186.06,34.92 U50.8 | v150.5,25.4 U47.3
  Bottom 0.406: v121.28,25.4 121.92,24.77 149.86,24.77 v150.5,25.4 151.13,24.77 180.97,24.77 v181.61,25.4 182.88,26.04 208.91,26.04 210.82,24.13 | 210.82,24.13 U46.3 | U17.3 226.69,22.23 224.16,24.77 211.46,24.77 210.82,24.13
RD_BUS_0_5  (via drill 0.5 pad 1.02)
  Top 0.406: U50.6 191.13,31.75 192.41,30.48 v192.41,24.77 | v205.74,18.41 U46.5
  Bottom 0.406: U51.5 116.2,24.13 145.41,24.13 | 145.41,24.13 176.53,24.13 | 176.53,24.13 190.5,24.13 191.13,24.77 v192.41,24.77 | v192.41,24.77 204.47,24.77 U46.5 | U47.5 145.41,24.13 | U48.5 176.53,24.13 | 193.04,24.77 v192.41,24.77 | U17.5 225.43,17.14 224.79,17.78 206.38,17.78 v205.74,18.41
RD_BUS_0_6  (via drill 0.5 pad 1.02)
  Top 0.406: U47.7 140.34,22.23 v142.24,20.32 | v111.12,20.32 U51.7 | U48.7 171.45,22.23 v173.35,20.32 | v198.12,20.32 U46.7 200.66,24.77 197.49,27.94 197.49,31.75 196.22,33.02 U50.4 | v222.25,12.06 v222.25,20.32
  Bottom 0.406: v111.12,20.32 111.76,20.95 141.6,20.95 v142.24,20.32 v173.35,20.32 v198.12,20.32 v222.25,20.32 | U17.7 v222.25,12.06
RD_BUS_0_7  (via drill 0.5 pad 1.02)
  Top 0.406: U50.2 201.29,31.11 202.56,29.84 202.56,24.77 201.93,24.13 v201.93,21.59 | v219.71,21.59 v219.71,6.99
  Bottom 0.406: U51.9 106.05,21.59 135.25,21.59 | 135.25,21.59 166.37,21.59 | 166.37,21.59 195.58,21.59 | 195.58,21.59 U46.9 | U47.9 135.25,21.59 | U48.9 166.37,21.59 | 195.58,21.59 v201.93,21.59 v219.71,21.59 | v219.71,6.99 U17.9
RD_BUS_1  (via drill 0.5 pad 1.02)
  Top 0.406: J7.18 62.23,5.08 v62.23,36.2
  Bottom 0.406: J5.23 10.16,45.72 19.68,36.2 v62.23,36.2 90.17,36.2 95.25,41.27 158.12,41.27 160.02,39.37 174.62,39.37 176.53,37.47 187.32,37.47 U50.7
RD_BUS_2  (via drill 0.5 pad 1.02)
  Top 0.406: v60.96,37.47 J7.19
  Bottom 0.406: J5.24 5.08,46.99 10.16,46.99 19.68,37.47 v60.96,37.47 90.17,37.47 94.61,41.91 158.75,41.91 160.66,40.01 175.26,40.01 177.16,38.1 191.77,38.1 U50.5
RD_BUS_3  (via drill 0.5 pad 1.02)
  Top 0.406: v59.69,38.73 59.69,5.08 J7.20
  Bottom 0.406: J5.25 10.16,48.26 19.68,38.73 v59.69,38.73 90.17,38.73 93.98,42.55 159.38,42.55 161.29,40.64 175.9,40.64 177.8,38.73 196.22,38.73 U50.3
RD_BUS_4  (via drill 0.5 pad 1.02)
  Top 0.406: J7.21 v58.42,40.01 | v183.51,40.64 184.78,39.37 184.78,34.92 183.51,33.66 U50.12
  Bottom 0.406: J5.26 5.08,49.53 10.16,49.53 19.68,40.01 v58.42,40.01 90.17,40.01 93.34,43.18 160.02,43.18 161.93,41.27 182.88,41.27 v183.51,40.64 184.78,39.37
RD_BUS_5  (via drill 0.5 pad 1.02)
  Top 0.406: v57.15,41.27 57.15,5.08 J7.22 | v189.23,40.64 189.87,40.01 189.87,35.56 188.59,33.66 U50.14
  Bottom 0.406: J5.27 10.16,50.8 19.68,41.27 v57.15,41.27 90.17,41.27 92.71,43.81 160.66,43.81 162.56,41.91 187.96,41.91 v189.23,40.64 189.87,40.01
RD_BUS_6  (via drill 0.5 pad 1.02)
  Top 0.406: v55.88,42.55 J7.23 | v191.77,40.64 192.41,40.01 192.41,33.66 193.68,32.38 U50.16
  Bottom 0.406: J5.28 4.45,50.8 5.71,52.07 10.16,52.07 19.68,42.55 v55.88,42.55 90.17,42.55 92.08,44.45 161.29,44.45 163.19,42.55 189.87,42.55 v191.77,40.64
RD_BUS_7  (via drill 0.5 pad 1.02)
  Top 0.406: J7.24 54.61,5.08 v54.61,43.81 | v197.49,40.64 197.49,34.29 198.75,33.02 U50.18
  Bottom 0.406: J5.29 10.16,53.34 19.68,43.81 v54.61,43.81 90.17,43.81 91.44,45.09 161.93,45.09 163.83,43.18 191.13,43.18 192.41,41.91 196.22,41.91 v197.49,40.64
WR_BUS_0  (via drill 0.5 pad 1.02)
  Top 0.406: U5.11 33.66,60.96 33.66,51.44 31.75,49.53 31.75,40.01 33.66,38.1 v33.66,14.61 | v83.82,14.61 J7.1 | v154.31,27.94 154.31,50.8 157.48,54.61 162.56,54.61 U15.2
  Bottom 0.406: J5.2 5.08,19.05 10.16,19.05 13.97,14.61 v33.66,14.61 v83.82,14.61 90.17,14.61 103.5,27.94 129.54,27.94 130.81,26.67 143.51,26.67 145.41,28.57 153.67,28.57 v154.31,27.94
WR_BUS_0_0  (via drill 0.5 pad 1.02)
  Top 0.406: U5.9 32.38,59.69 31.11,60.96 v31.11,75.56
  Bottom 0.406: U1.18 11.43,74.93 30.48,74.93 v31.11,75.56 31.75,74.93 40.64,74.93 | 40.64,74.93 U2.18 | U3.18 71.12,74.93 | 71.12,74.93 40.64,74.93 | 71.12,74.93 100.33,74.93 | 100.33,74.93 130.81,74.93 | 130.81,74.93 160.02,74.93 | 160.02,74.93 190.5,74.93 | 190.5,74.93 218.44,74.93 U9.18 | U4.18 100.33,74.93 | U6.18 130.81,74.93 | U7.18 160.02,74.93 | U8.18 190.5,74.93
WR_BUS_0_1  (via drill 0.5 pad 1.02)
  Top 0.406: U1.17 v13.97,73.66 | v43.18,73.66 U2.17 | U3.17 v73.66,73.66 | U4.17 v102.87,73.66 | U6.17 v133.35,73.66 | U7.17 v162.56,73.66 | U8.17 v193.04,73.66 | U9.17 v222.25,73.66 | v27.94,73.66 27.94,64.77 28.57,64.14 28.57,61.59 27.3,60.33 U5.7
  Bottom 0.406: v13.97,73.66 14.61,74.3 26.04,74.3 26.67,73.66 v27.94,73.66 37.47,73.66 38.1,74.3 42.55,74.3 v43.18,73.66 43.81,73.66 44.45,74.3 72.39,74.3 73.03,73.66 v73.66,73.66 74.3,74.3 102.23,74.3 v102.87,73.66 103.5,74.3 132.72,74.3 v133.35,73.66 133.99,74.3 161.93,74.3 v162.56,73.66 163.19,74.3 192.41,74.3 v193.04,73.66 193.68,74.3 221.62,74.3 v222.25,73.66
WR_BUS_0_2  (via drill 0.5 pad 1.02)
  Top 0.406: U1.14 v21.59,73.03 20.95,73.03 17.78,69.85 17.78,66.67 20.95,63.5 20.95,55.88 U5.5 | v50.8,73.03 U2.14 | U3.14 v81.28,73.03 | U4.14 v110.49,73.03 | U6.14 v140.97,73.03 | U7.14 v170.18,73.03 | U8.14 v200.66,73.03 | U9.14 v229.87,73.03
  Bottom 0.406: v21.59,73.03 22.23,73.66 24.77,73.66 26.04,72.39 38.1,72.39 39.37,73.66 41.27,73.66 42.55,72.39 50.16,72.39 v50.8,73.03 51.44,73.66 71.75,73.66 73.03,72.39 80.64,72.39 v81.28,73.03 81.92,73.66 100.97,73.66 102.23,72.39 109.86,72.39 v110.49,73.03 111.12,73.66 131.44,73.66 132.72,72.39 140.34,72.39 v140.97,73.03 141.6,73.66 160.66,73.66 161.93,72.39 169.54,72.39 v170.18,73.03 170.81,73.66 191.13,73.66 192.41,72.39 200.03,72.39 v200.66,73.03 201.29,73.66 220.34,73.66 221.62,72.39 229.24,72.39 v229.87,73.03
WR_BUS_0_3  (via drill 0.5 pad 1.02)
  Top 0.406: U1.13 v24.13,72.39 | v53.34,72.39 U2.13 | U3.13 v83.82,72.39 | U4.13 v113.03,72.39 | U6.13 v143.51,72.39 | U7.13 v172.72,72.39 | U8.13 v203.2,72.39 | U9.13 v232.41,72.39 | v15.24,72.39 15.24,64.14 15.88,63.5 15.88,55.88 U5.3
  Bottom 0.406: v232.41,72.39 231.78,71.75 220.98,71.75 220.34,72.39 v203.2,72.39 202.56,72.39 201.93,71.75 191.77,71.75 191.13,72.39 v172.72,72.39 172.09,71.75 161.29,71.75 160.66,72.39 v143.51,72.39 142.88,71.75 132.08,71.75 131.44,72.39 v113.03,72.39 112.39,71.75 101.6,71.75 100.97,72.39 v83.82,72.39 83.19,71.75 72.39,71.75 71.75,72.39 v53.34,72.39 52.7,71.75 41.91,71.75 41.27,72.39 39.37,72.39 38.73,71.75 24.77,71.75 v24.13,72.39 23.5,71.75 15.88,71.75 v15.24,72.39
WR_BUS_0_4  (via drill 0.5 pad 1.02)
  Top 0.406: U1.8 v24.13,66.04 | v53.34,66.04 U2.8 | U3.8 v83.82,66.04 | U4.8 v113.03,66.04 | U6.8 v143.51,66.04 | U9.8 v232.41,66.04 | U8.8 v203.2,66.04 | U7.8 v172.72,66.04
  Bottom 0.406: v24.13,66.04 32.38,66.04 | 32.38,66.04 v53.34,66.04 v83.82,66.04 v113.03,66.04 v143.51,66.04 v172.72,66.04 v203.2,66.04 v232.41,66.04 | U5.12 32.38,66.04
WR_BUS_0_5
  Bottom 0.406: 50.8,67.31 U2.7 | U3.7 81.28,67.31 | 81.28,67.31 50.8,67.31 | U6.7 140.97,67.31 | 140.97,67.31 110.49,67.31 | 110.49,67.31 81.28,67.31 | U4.7 110.49,67.31 | U7.7 170.18,67.31 | 170.18,67.31 140.97,67.31 | U9.7 229.87,67.31 200.66,67.31 | 200.66,67.31 170.18,67.31 | U8.7 200.66,67.31 | 50.8,67.31 21.59,67.31 | 21.59,67.31 U1.7 | U5.14 27.3,64.77 22.86,64.77 21.59,66.04 21.59,67.31
WR_BUS_0_6  (via drill 0.5 pad 1.02)
  Top 0.406: v43.18,69.85 U2.4
  Bottom 0.406: U3.4 73.66,69.85 | 73.66,69.85 v43.18,69.85 13.97,69.85 U1.4 15.24,67.31 17.14,67.31 U5.16 | U4.4 102.87,69.85 | 102.87,69.85 73.66,69.85 | U6.4 133.35,69.85 | 133.35,69.85 102.87,69.85 | U7.4 162.56,69.85 | 162.56,69.85 133.35,69.85 | U8.4 193.04,69.85 | 193.04,69.85 162.56,69.85 | U9.4 222.25,69.85 193.04,69.85
WR_BUS_0_7  (via drill 0.5 pad 1.02)
  Top 0.406: v40.64,71.12 U2.3 | U3.3 v71.12,71.12 | U4.3 v100.33,71.12 | U6.3 v130.81,71.12 | U7.3 v160.02,71.12 | U8.3 v190.5,71.12 | U9.3 v219.71,71.12
  Bottom 0.406: v219.71,71.12 v190.5,71.12 v160.02,71.12 v130.81,71.12 v100.33,71.12 v71.12,71.12 v40.64,71.12 11.43,71.12 U1.3 11.43,67.94 U5.18
WR_BUS_1  (via drill 0.5 pad 1.02)
  Top 0.406: U5.13 29.84,57.78 28.57,56.52 v28.57,15.88 | v82.55,15.88 82.55,5.08 J7.2 | v155.57,28.57 155.57,50.8 156.21,51.44 168.91,51.44 U15.4
  Bottom 0.406: J5.3 10.16,20.32 13.97,15.88 v28.57,15.88 v82.55,15.88 90.17,15.88 102.87,28.57 130.18,28.57 131.44,27.3 142.88,27.3 144.78,29.21 154.94,29.21 v155.57,28.57
WR_BUS_2  (via drill 0.5 pad 1.02)
  Top 0.406: U5.15 23.5,60.96 v23.5,17.14 | v81.28,17.14 J7.3 | v156.84,29.21 v156.84,50.16
  Bottom 0.406: J5.4 5.08,21.59 10.16,21.59 13.97,17.14 v23.5,17.14 v81.28,17.14 90.17,17.14 102.23,29.21 130.81,29.21 132.08,27.94 142.24,27.94 144.15,29.84 156.21,29.84 v156.84,29.21 | v156.84,50.16 157.48,51.44 174.62,51.44 175.26,52.07 U15.6
WR_BUS_3  (via drill 0.5 pad 1.02)
  Top 0.406: U5.17 18.41,60.96 v18.41,18.41 | v80.01,18.41 80.01,5.08 J7.4 | v158.12,29.84 v158.12,50.16
  Bottom 0.406: J5.5 10.16,22.86 13.97,18.41 v18.41,18.41 v80.01,18.41 90.17,18.41 101.6,29.84 131.44,29.84 132.72,28.57 141.6,28.57 143.51,30.48 157.48,30.48 v158.12,29.84 | v158.12,50.16 177.8,50.16 U15.8
WR_BUS_4  (via drill 0.5 pad 1.02)
  Top 0.406: v29.84,19.68 U5.8 | v78.74,19.68 J7.5 | v159.38,30.48 159.38,49.53 160.66,50.8 170.18,50.8 171.45,52.07 171.45,59.05 U15.17
  Bottom 0.406: J5.6 5.08,24.13 10.16,24.13 13.97,19.68 v29.84,19.68 v78.74,19.68 90.17,19.68 100.97,30.48 132.08,30.48 133.35,29.21 140.97,29.21 142.88,31.11 158.75,31.11 v159.38,30.48
WR_BUS_5  (via drill 0.5 pad 1.02)
  Top 0.406: U5.6 v24.77,20.95 | v77.47,20.95 77.47,5.08 J7.6 | v160.66,31.11 160.66,48.9 161.93,50.16 172.72,50.16 173.99,51.44 173.99,59.05 U15.15
  Bottom 0.406: J5.7 10.16,25.4 13.97,20.95 v24.77,20.95 v77.47,20.95 90.17,20.95 100.33,31.11 132.72,31.11 133.99,29.84 140.34,29.84 142.24,31.75 160.02,31.75 v160.66,31.11
WR_BUS_6  (via drill 0.5 pad 1.02)
  Top 0.406: U5.4 v19.68,22.23 | v76.2,22.23 J7.7 | v161.93,31.75 161.93,48.26 163.19,49.53 175.26,49.53 176.53,50.8 176.53,56.52 U15.13
  Bottom 0.406: J5.8 5.08,26.67 10.16,26.67 13.97,22.23 v19.68,22.23 v76.2,22.23 90.17,22.23 99.69,31.75 133.35,31.75 134.62,30.48 139.7,30.48 141.6,32.38 161.29,32.38 v161.93,31.75
WR_BUS_7  (via drill 0.5 pad 1.02)
  Top 0.406: U5.2 v14.61,23.5 | v74.93,23.5 74.93,5.08 J7.8 | v163.19,32.38 163.19,47.62 164.47,48.9 177.8,48.9 179.07,50.16 179.07,56.52 180.97,58.42 183.51,58.42 U15.11
  Bottom 0.406: J5.9 10.79,27.94 v14.61,23.5 v74.93,23.5 90.17,23.5 99.06,32.38 133.99,32.38 135.25,31.11 139.06,31.11 140.97,33.02 162.56,33.02 v163.19,32.38

## Text on the board
tPlace: W0 | W1 | W2 | W3 | 0V | +5V | Gnd | 7 | 6 | 5 | 4 | 3 | 2 | 1 | 0 | Brd No. | Test I/O Board (1) | James Newman | Gnd | Downstream | Upstream | Gnd | R1 | R0